# Altium schematic sheet LitVP-V3.SchDoc
size A2
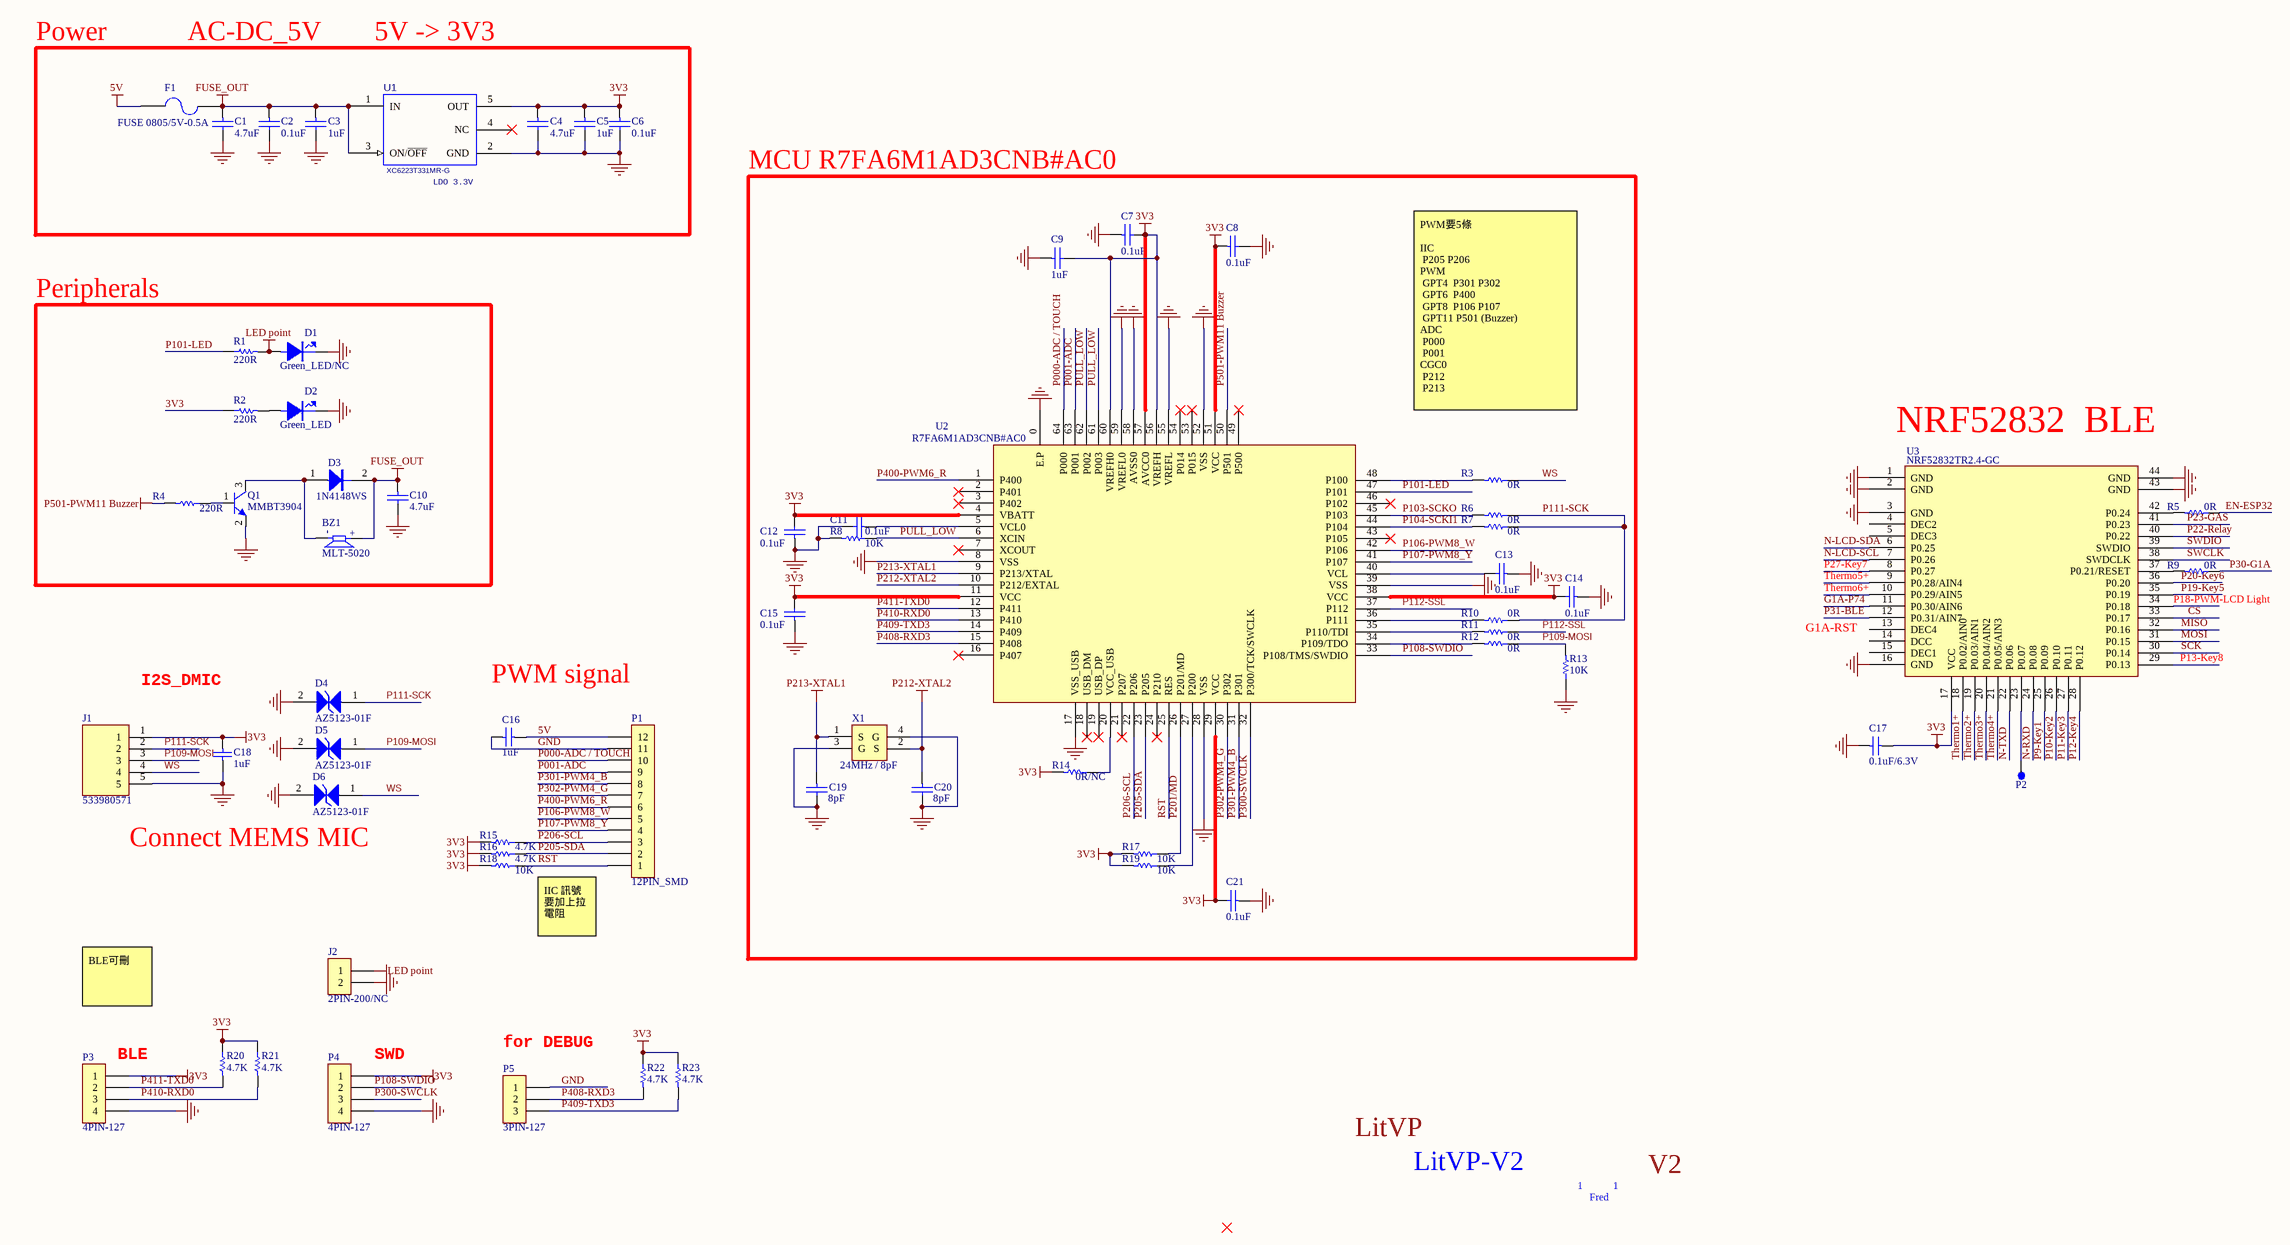
[diagram p0: LitVP-V3.SchDoc]

## Parts
BZ1  MLT-5020  [BUZZER-SMD-5*5mm]
C1  4.7uF  [0402C]
C2  0.1uF  [0402C]
C3  1uF  [0402C]
C4  4.7uF  [0402C]
C5  1uF  [0402C]
C6  0.1uF  [0402C]
C7  0.1uF  [0402C]
C8  0.1uF  [0402C]
C9  1uF  [0402C]
C10  4.7uF  [0402C]
C11  0.1uF  [0402C]
C12  0.1uF  [0402C]
C13  0.1uF  [0402C]
C14  0.1uF  [0402C]
C15  0.1uF  [0402C]
C16  1uF  [0402C]
C17  0.1uF/6.3V  [0402C]
C18  1uF  [0402C]
C19  8pF  [0402C]
C20  8pF  [0402C]
C21  0.1uF  [0402C]
D1  Green_LED/NC  [LED0603--0.4mm]
D2  Green_LED  [LED0603--0.4mm]
D3  1N4148WS  [SOD323-1N4148WS - pig pad]
D4  AZ5123-01F  [DIODE-0402]
D5  AZ5123-01F  [DIODE-0402]
D6  AZ5123-01F  [DIODE-0402]
F1  FUSE 0805/5V-0.5A  [0805_FUSE]
J1  533980571  [53398-0571]
J2  2PIN-200/NC  [2PIN-127]
P1  12PIN_SMD  [12PIN_SAMTEC-MMT-136-02-X-SH]
P2  TP  [TESTPAD-1X0.6MM-1]  (value not drawn)
P3  4PIN-127  [4PIN-127_0.85_0.505]
P4  4PIN-127  [4PIN-127_0.85_0.505]
P5  3PIN-127  [3PIN-127]
Q1  MMBT3904  [SOT-23]
R1  220R  [0402]
R2  220R  [0402]
R3  0R  [0402]
R4  220R  [0402]
R5  0R  [0402]
R6  0R  [0402]
R7  0R  [0402]
R8  10K  [0402]
R9  0R  [0402]
R10  0R  [0402]
R11  0R  [0402]
R12  0R  [0402]
R13  10K  [0402]
R14  0R/NC  [0402]
R15  4.7K  [0402]
R16  4.7K  [0402]
R17  10K  [0402]
R18  10K  [0402]
R19  10K  [0402]
R20  4.7K  [0402]
R21  4.7K  [0402]
R22  4.7K  [0402]
R23  4.7K  [0402]
U1  XC6223T331MR-G  [SOT-23-5-0.95MM]
U2  R7FA6M1AD3CNB#AC0  [QFN64-0.4mm-8X8]
U3  NRF52832TR2.4-GC  [NRF52832TR2.4-GC]
X1  24MHz / 8pF  [XTAL-SMD-20X16]

## Blocks framed on the sheet
MCU R7FA6M1AD3CNB#AC0: C7-C9 C11-C15 C19-C21 R3 R6-R8 R10-R14 R17 R19 U2 X1
Peripherals: BZ1 C10 D1-D3 Q1 R1 R2 R4

## Nets
3V3: C4.1 C5.1 C6.1 C7.2 C8.1 C9.2 C12.2 C14.2 C15.2 C17.1 C18.2 C21.2 J1.1 P3.1 P4.1 R2.1 R14.2 R15.2 R16.2 R17.2 R18.2 R19.2 R20.1 R21.1 R22.1 R23.1 U1.5(OUT) U2.4(VBATT) U2.11(VCC) U2.29(VCC) U2.38(VCC) U2.51(VCC) U2.56(VREFH) U2.57(AVCC0) U2.60(VREFH0) U3.17(VCC)
5V: C16.1 F1.1 P1.12
FUSE_OUT: BZ1.1 C1.1 C2.1 C3.1 C10.1 D3.2 F1.2 U1.1(IN) U1.3(ON/~{OFF})
GND: C1.2 C2.2 C3.2 C4.2 C5.2 C6.2 C7.1 C8.2 C9.1 C10.2 C11.2 C12.1 C13.1 C14.1 C15.1 C16.2 C17.2 C18.1 C19.2 C20.2 C21.1 D1.2 D2.2 D4.2 D5.2 D6.2 J1.5 J2.2 P1.11 P3.4 P4.4 P5.1 Q1.2(E) R8.2 R13.1 U1.2(GND) U2.0(E.P) U2.8(VSS) U2.17(VSS_USB) U2.28(VSS) U2.39(VSS) U2.52(VSS) U2.55(VREFL) U2.58(AVSS0) U2.59(VREFL0) U3.1(GND) U3.2(GND) U3.3(GND) U3.16(GND) U3.43(GND) U3.44(GND) X1.3(G) X1.4(G)
LED point: D1.1 J2.1 R1.2
P212-XTAL2: C20.1 U2.10(P212/EXTAL) X1.2(S)
P213-XTAL1: C19.1 U2.9(P213/XTAL) X1.1(S)
P501-PWM11 Buzzer: R4.2 U2.50(P501)
CS: U3.33(P0.17)
EN-ESP32: R5.1
G1A-P74: U3.11(P0.30/AIN6)
MISO: U3.32(P0.16)
MOSI: U3.31(P0.15)
N-LCD-SCL: U3.7(P0.26)
N-LCD-SDA: U3.6(P0.25)
N-RXD: U3.24(P0.08)
N-TXD: U3.22(P0.06)
P000-ADC / TOUCH: P1.10 U2.64(P000)
P001-ADC: P1.9 U2.63(P001)
P9-Key1: U3.25(P0.09)
P10-Key2: U3.26(P0.10)
P11-Key3: U3.27(P0.11)
P12-Key4: U3.28(P0.12)
P13-Key8: U3.29(P0.13)
P18-PWM-LCD Light: U3.34(P0.18)
P19-Key5: U3.35(P0.19)
P20-Key6: U3.36(P0.20)
P22-Relay: U3.40(P0.22)
P23-GAS: U3.41(P0.23)
P27-Key7: U3.8(P0.27)
P30-G1A: R9.1
P31-BLE: U3.12(P0.31/AIN7)
P101-LED: R1.1 U2.47(P101)
P103-SCKO: R6.2 U2.45(P103)
P104-SCKI1: R7.2 U2.44(P104)
P106-PWM8_W: P1.5 U2.42(P106)
P107-PWM8_Y: P1.4 U2.41(P107)
P108-SWDIO: P4.2 U2.33(P108/TMS/SWDIO)
P109-MOSI: D5.1 J1.3 R12.1 R13.2
P111-SCK: D4.1 J1.2 R6.1 R7.1 R10.1
P112-SSL: R11.1 U2.37(P112)
P201/MD: R17.1 U2.26(P201/MD)
P205-SDA: P1.2 R16.1 U2.23(P205)
P206-SCL: P1.3 R15.1 U2.22(P206)
P300-SWCLK: P4.3 U2.32(P300/TCK/SWCLK)
P301-PWM4_B: P1.8 U2.31(P301)
P302-PWM4_G: P1.7 U2.30(P302)
P400-PWM6_R: P1.6 U2.1(P400)
P408-RXD3: P5.2 R22.2 U2.15(P408)
P409-TXD3: P5.3 R23.2 U2.14(P409)
P410-RXD0: P3.3 R21.2 U2.13(P410)
P411-TXD0: P3.2 R20.2 U2.12(P411)
PULL_LOW: R8.1 U2.6(XCIN) U2.61(P003) U2.62(P002)
RST: P1.1 R18.1 U2.25(RES)
SCK: U3.30(P0.14)
SWCLK: U3.38(SWDCLK)
SWDIO: U3.39(SWDIO)
Thermo1+: U3.18(P0.02/AIN0)
Thermo2+: U3.19(P0.03/AIN1)
Thermo3+: U3.20(P0.04/AIN2)
Thermo4+: U3.21(P0.05/AIN3)
Thermo5+: U3.9(P0.28/AIN4)
Thermo6+: U3.10(P0.29/AIN5)
WS: D6.1 J1.4 R3.1
NetBZ1_2: BZ1.2 D3.1 Q1.3(C)
NetC11_1: C11.1 U2.5(VCL0)
NetC13_2: C13.2 U2.40(VCL)
NetD2_1: D2.1 R2.2
NetP2_1: P2.1 U3.23(P0.07)
NetQ1_1: Q1.1(B) R4.1
NetR3_2: R3.2 U2.48(P100)
NetR5_2: R5.2 U3.42(P0.24)
NetR9_2: R9.2 U3.37(P0.21/RESET)
NetR10_2: R10.2 U2.36(P111)
NetR11_2: R11.2 U2.35(P110/TDI)
NetR12_2: R12.2 U2.34(P109/TDO)
NetR14_1: R14.1 U2.20(VCC_USB)
NetR19_1: R19.1 U2.27(P200)

Not connected (* = marked no-connect by the designer): U1 4(NC)*; U2 2(P401)* 3(P402)* 7(XCOUT)* 16(P407)* 18(USB_DM)* 19(USB_DP)* 21(P207)* 24(P210)* 43(P105)* 46(P102)* 49(P500)* 53(P015)* 54(P014)*; U3 4(DEC2) 5(DEC3) 13(DEC4) 14(DCC) 15(DEC1)

## Notes on the sheet
- Power
- AC-DC_5V
- 5V -> 3V3
- (near U1) LDO 3.3V
- PWM要5條
  IIC
  P205 P206
  PWM
  GPT4  P301 P302
  GPT6  P400
  GPT8  P106 P107
  GPT11 P501 (Buzzer)
  ADC
  P000
  P001
  CGC0
  P212
  P213
- (near U3) NRF52832  BLE
- G1A-RST
- I2S_DMIC
- PWM signal
- Connect MEMS MIC
- IIC 訊號要加上拉電阻
- BLE可刪
- (near P3) BLE
- (near P4) SWD
- (near P5) for DEBUG
- DEBUG PIN 沒用到可刪
- UART4 相關刪除
- 可以藉由標記PIN編號來讓走縣更OK嗎？
- LitVP
- LitVP-V2
- 1
- V2
- Fred
- (in symbol ET-5040S1) -; +

## Library data of the parts
BZ1 = ET-5040S1: Buzzer; Value: MLT-5020
C1-C15 C19-C21 = CAP: Capacitor
  C1 C4 C10: Value: 4.7uF
  C2 C6-C8 C11-C15 C21: Value: 0.1uF
  C3 C5 C9: Value: 1uF
  C19 C20: Value: 8pF
C16 C18 = Cap Semi: Capacitor; Value: 1uF
C17 = Cap Semi: Capacitor (Semiconductor SIM Model); Published: 8-Jun-2000; LatestRevisionDate: 17-Jul-2002; LatestRevisionNote: Re-released for DXP Platform.; PackageReference: C1206; Publisher: Altium Limited; Value: 0.1uF/6.3V
D1 D2 = LED: Manufacturer's Part Number: CL-170G-CD-T; Part Number: 41100017000; Manufacturer: Citizen; Old Part Number: 4317000; Right: 40; Bottom: 20; VALUE_ALLEGRO: Red_LED; Package Height: 1.1mm; FPLIST: mot/0805LED,dig/0805led; PCB_x: 46.095000; PCB_y: 6.420000; PCB_dir: 90.000000; Cost: 0.48
  D1: Value: Green_LED/NC
  D2: Value: Green_LED
D3 = DIODE: Value: 1N4148WS
D4-D6 = PESD5V0L1BA: ESD; Value: AZ5123-01F
F1 = FUSE2: Fuse; Value: FUSE 0805/5V-0.5A
J1 = 53048-0510: Connector; Manufacturer_Name: Molex; Datasheet Link: https://componentsearchengine.com/Datasheets/2/53048-0510.pdf; Height: 3.7mm; Manufacturer_Part_Number: 53048-0510; Value: 533980571
J2 = 2PIN-200: Connector; Value: 2PIN-200/NC
P3 P4 = CON4: 1.27mm Header; Value: 4PIN-127
Q1 = NPN-3: NPN General Purpose Amplifier; Published: *; LatestRevisionDate: *; LatestRevisionNote: *; DatasheetDocument: *; PackageDocument: *; PackageReference: *; Publisher: *; Code_JEDEC: *; ComponentLink1Description: *; ComponentLink1URL: *; ComponentLink2Description: *; ComponentLink2URL: *; Value: MMBT3904
R1-R4 R6-R8 R10-R23 = Res Semi: Resistor
  R1 R2 R4: Value: 220R
  R3 R6 R7 R10-R12: Value: 0R
  R8 R13 R17-R19: Value: 10K
  R14: Value: 0R/NC
  R15 R16 R20-R23: Value: 4.7K
R5 R9 = Res Semi: Semiconductor Resistor; Published: 8-Jun-2000; LatestRevisionDate: 17-Jul-2002; LatestRevisionNote: Re-released for DXP Platform.; PackageReference: AXIAL-0.5; Publisher: Altium Limited; Value: 0R
U2 = R7FA6M1AD3CNB#AC0: MCU; Value: R7FA6M1AD3CNB#AC0
X1 = XTAL-SMD-25*32: Value: 24MHz / 8pF
P1 = 12PIN_SMD: Value: 12PIN_SMD
P5 = 3PIN-127: Value: 3PIN-127
U1 = XC6223T331MR-G: Value: XC6223T331MR-G